# EAGLE design zero_board (EAGLE 6.6.0)
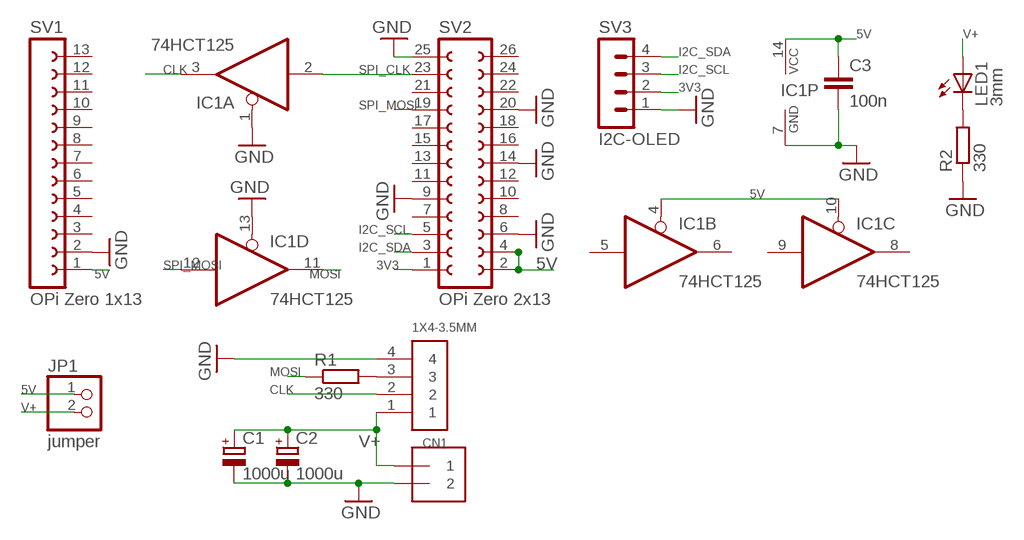
[diagram p0: schematic, sheet 1]

## Parts
C1  1000u  CPOL-EUE5-6  [E5-6]
C2  1000u  CPOL-EUE5-6  [E5-6]
C3  100n  C-EU050-024X044  [C050-024X044]
CN1  1X4-3.5MM  [1X04-3.5MM]
IC1  74HCT125  74HCT125N  [DIL14]
J1  1X2-3.5MM  [1X2-3.5MM]
JP1  jumper  PINHD-1X2  [1X02]
LED1  3mm  LED3MM  [LED3MM]
R1  330  R-EU_0204/7  [0204/7]
R2  330  R-EU_0204/7  [0204/7]
SV1  OPi Zero 1x13  FE13-1  [FE13]
SV2  OPi Zero 2x13  FE13-2  [FE13-2]
SV3  I2C-OLED  MA04-1  [MA04-1]

## Nets
3V3: SV2.1 SV3.2
5V: C3.1 IC1.4(B:OE) IC1.10(C:OE) IC1.14(P:VCC) JP1.1 SV1.1 SV2.2 SV2.4
CLK: CN1.2 IC1.3(A:O)
GND: C1.- C2.- C3.2 CN1.4 IC1.1(A:OE) IC1.7(P:GND) IC1.13(D:OE) J1.2 R2.1 SV1.2 SV2.6 SV2.9 SV2.14 SV2.20 SV2.25 SV3.1
I2C_SCL: SV2.5 SV3.3
I2C_SDA: SV2.3 SV3.4
MOSI: IC1.11(D:O) R1.1
N$1: LED1.K(C) R2.2
N$2: CN1.3 R1.2
SPI_CLK: IC1.2(A:I) SV2.23
SPI_MOSI: IC1.12(D:I) SV2.19
V+: C1.+ C2.+ CN1.1 J1.1 JP1.2 LED1.A
Unconnected: IC1.5(B:I) IC1.6(B:O) IC1.8(C:O) IC1.9(C:I) SV1.3 SV1.4 SV1.5 SV1.6 SV1.7 SV1.8 SV1.9 SV1.10 SV1.11 SV1.12 SV1.13 SV2.7 SV2.8 SV2.10 SV2.11 SV2.12 SV2.13 SV2.15 SV2.16 SV2.17 SV2.18 SV2.21 SV2.22 SV2.24 SV2.26

## Library data of the parts
C1 C2 = rcl:CPOL-EU: POLARIZED CAPACITOR, European symbol
C3 = rcl:C-EU: CAPACITOR, European symbol
CN1 = adafruit:1X4: 4-pin connector
IC1 = 74xx-eu:74*125: Quad bus BUFFER, 3-state
J1 = adafruit:1X2: 3.5mm Terminal block http://www.ladyada.net/library/pcb/eaglelibrary.html
JP1 = pinhead:PINHD-1X2: PIN HEADER
LED1 = led:LED: LED OSRAM: - CHIPLED LG R971, LG N971, LY N971, LG Q971, LY Q971, LO R971, LY R971 LH N974, LH R974 LS Q976, LO Q976, LY Q976 LO Q996 - Hyper CHIPLED LW Q18S LB Q993, LB Q99A, LB R99A - SideLED LS A670, LO A670, LY A670, LG A670, LP A670 LB A673, LV A673, LT A673, LW A673 LH A674 LY A675 LS A676, LA A676, LO A676, LY A676, LW A676 LS A679, LY A679, LG A679 - Hyper Micro SIDELED® LS Y876, LA Y876, LO Y876, LY Y876 LT Y87S - SmartLED LW L88C, LW L88S LB L89C, LB L89S, LG L890 LS L89K, LO L89K, LY L89K LS L896, LA L896, LO L896, LY L896 - TOPLED LS T670, LO T670, LY T670, LG T670, LP T670 LSG T670, LSP T670, LSY T670, LOP T670, LYG T670 LG T671, LOG T671, LSG T671 LB T673, LV T673, LT T673, LW T673 LH T674 LS T676, LA T676, LO T676, LY T676, LB T676, LH T676, LSB T676, LW T676 LB T67C, LV T67C, LT T67C, LS T67K, LO T67K, LY T67K, LW E67C LS E67B, LA E67B, LO E67B, LY E67B, LB E67C, LV E67C, LT E67C LW T67C LS T679, LY T679, LG T679 LS T770, LO T770, LY T770, LG T770, LP T770 LB T773, LV T773, LT T773, LW T773 LH T774 LS E675, LA E675, LY E675, LS T675 LS T776, LA T776, LO T776, LY T776, LB T776 LHGB T686 LT T68C, LB T68C - Hyper Mini TOPLED® LB M676 - Mini TOPLED Santana® LG M470 LS M47K, LO M47K, LY M47K Source: http://www.osram.convergy.de LUXEON: - LUMILED® LXK2-PW12-R00, LXK2-PW12-S00, LXK2-PW14-U00, LXK2-PW14-V00 LXK2-PM12-R00, LXK2-PM12-S00, LXK2-PM14-U00 LXK2-PE12-Q00, LXK2-PE12-R00, LXK2-PE12-S00, LXK2-PE14-T00, LXK2-PE14-U00 LXK2-PB12-K00, LXK2-PB12-L00, LXK2-PB12-M00, LXK2-PB14-N00, LXK2-PB14-P00, LXK2-PB14-Q00 LXK2-PR12-L00, LXK2-PR12-M00, LXK2-PR14-Q00, LXK2-PR14-R00 LXK2-PD12-Q00, LXK2-PD12-R00, LXK2-PD12-S00 LXK2-PH12-R00, LXK2-PH12-S00 LXK2-PL12-P00, LXK2-PL12-Q00, LXK2-PL12-R00 Source: www.luxeon.com KINGBRIGHT: KA-3528ASYC Source: www.kingbright.com
R1 R2 = rcl:R-EU_: RESISTOR, European symbol
SV1 = con-lsta:FE13-1: FEMALE HEADER; OC_FARNELL: unknown; OC_NEWARK: unknown
SV2 = con-lsta:FE13-2: FEMALE HEADER; OC_FARNELL: unknown; OC_NEWARK: unknown
SV3 = con-lstb:MA04-1: PIN HEADER; OC_FARNELL: unknown; OC_NEWARK: unknown

## Board
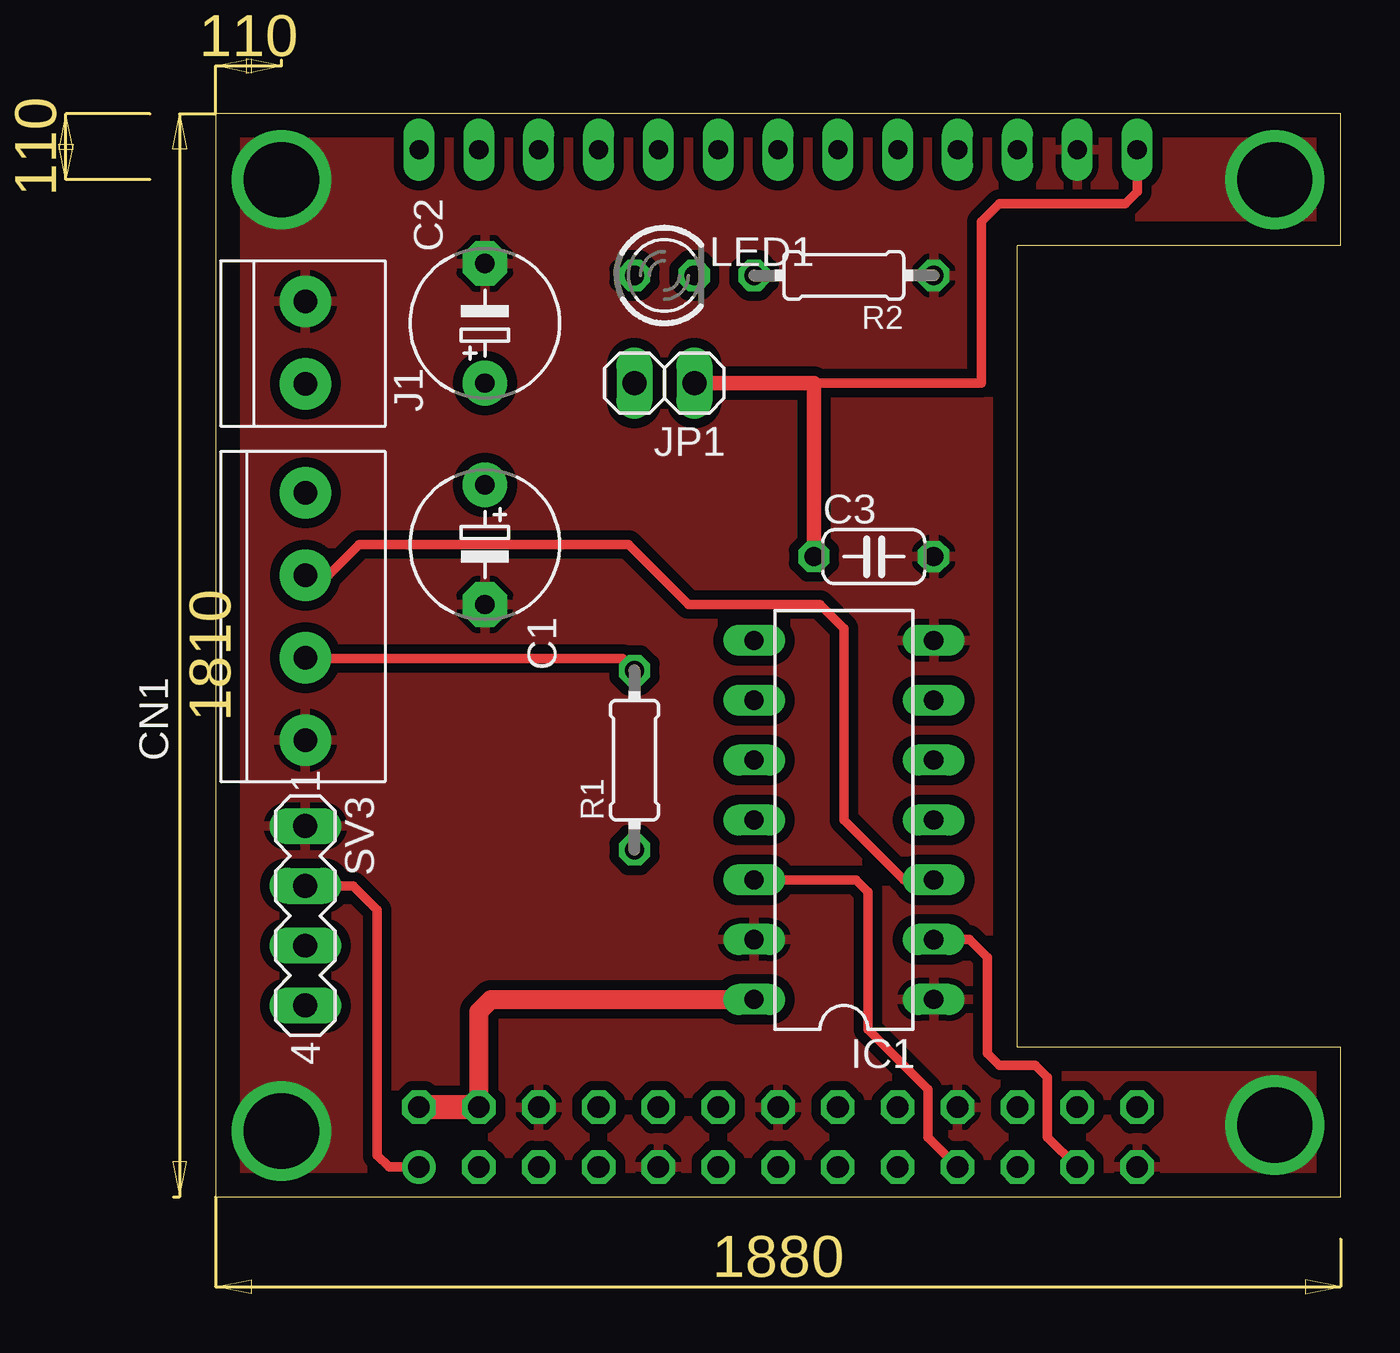
[diagram p1: board, top side]
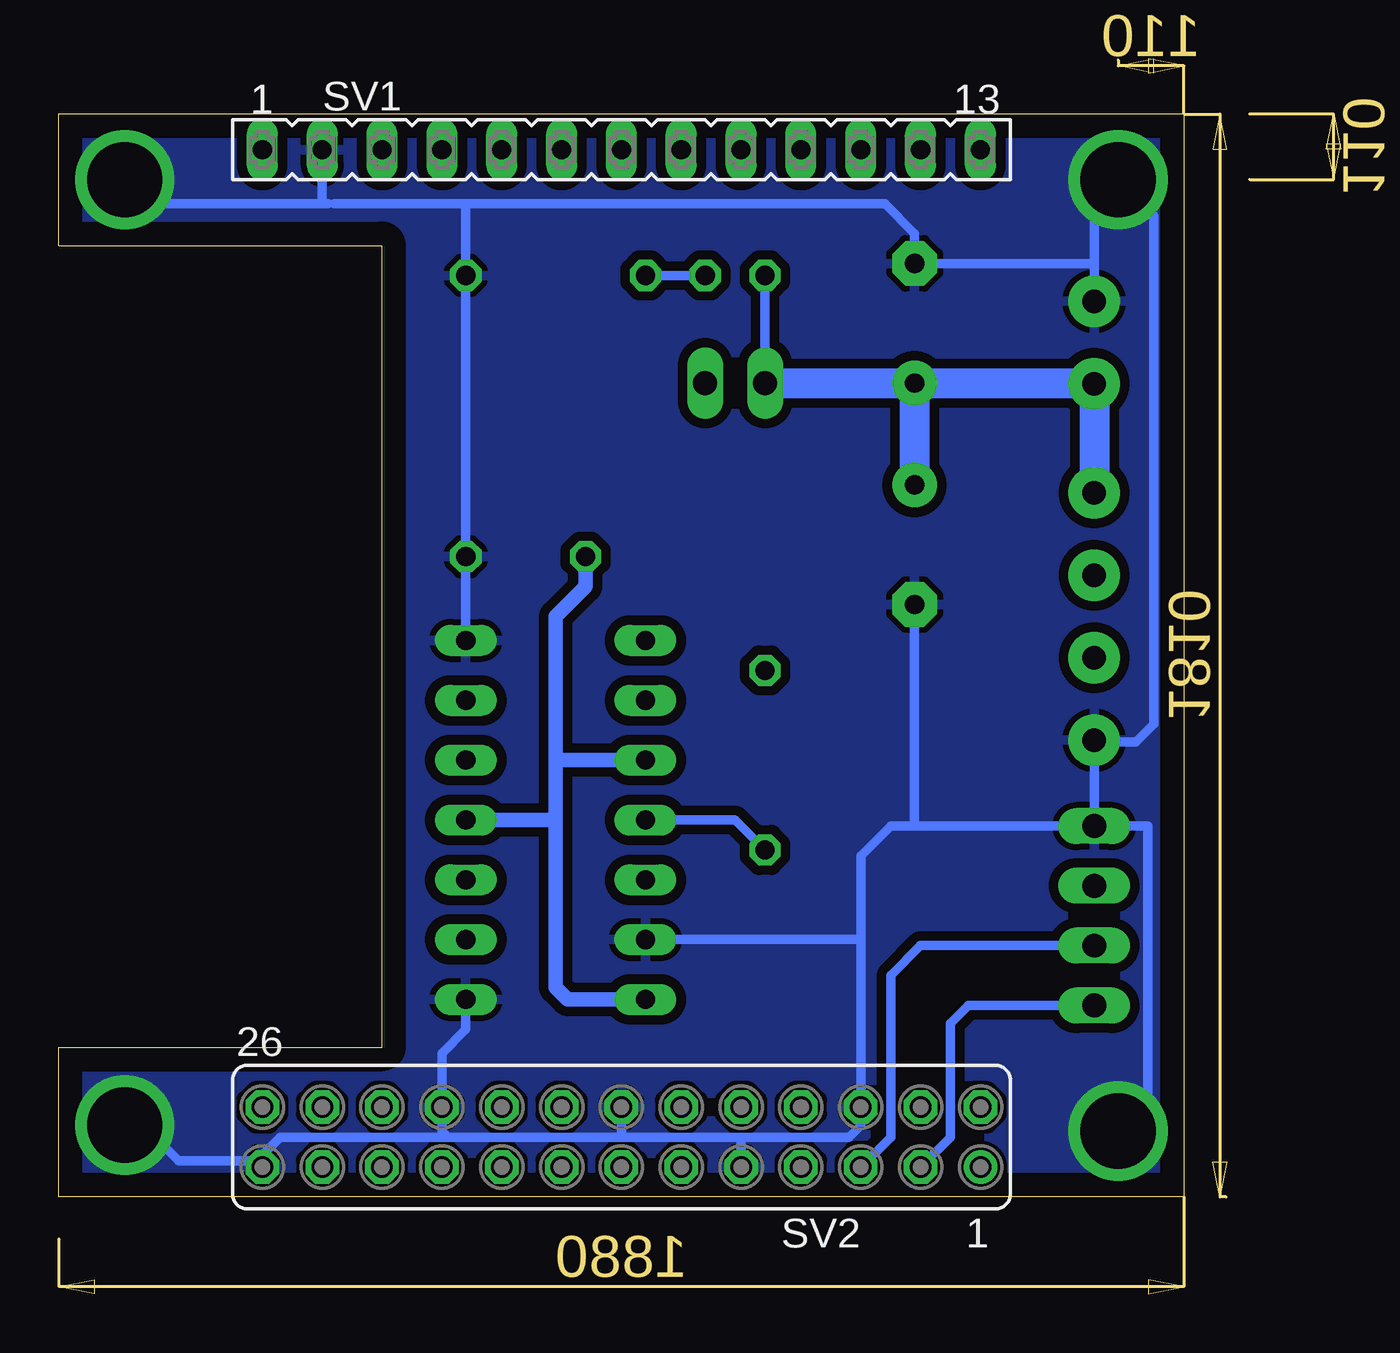
[diagram p2: board, bottom side, seen from below]

Size 47.75 x 45.97 mm. Coordinates in mm from the lower left corner, seen from the top.
Outline: 0,45.96 0,0 47.75,0 47.75,6.35 34.04,6.35 34.04,40.39 47.75,40.39 47.75,45.97 0,45.97
Copper layers (1*16): Top 0.035mm / dielectric 1.5mm / Bottom 0.035mm
Design rules "default": minimum track width 10mil, minimum drill 24mil, track to track 8mil, track to pad 8mil, pad to pad 8mil, via to via 8mil, smd to smd 8mil, copper to edge 40mil, drill to drill 8mil, minimum pad ring 10mil, minimum via ring 8mil, stop-mask expansion 4mil, vias tented up to drill 0mil, thermal gap 10mil

### Footprints (pad centres in the part's own frame; a part is rotated, then mirrored left to right if it is on the bottom)
E5-6 = drill 0.813 pad 1.905: + -2.54,0 | drill 0.813 pad 1.905 octagon: - 2.54,0
C050-024X044 = drill 0.813 octagon: 1 -2.54,0; 2 2.54,0
1X04-3.5MM = drill 1 pad 2.184: 1 -5.25,0; 2 -1.75,0; 3 1.75,0; 4 5.25,0
DIL14 = drill 0.813 long: 1 -7.62,-3.81; 2 -5.08,-3.81; 3 -2.54,-3.81; 4 0,-3.81; 5 2.54,-3.81; 6 5.08,-3.81; 7 7.62,-3.81; 8 7.62,3.81; 9 5.08,3.81; 10 2.54,3.81; 11 0,3.81; 12 -2.54,3.81; 13 -5.08,3.81; 14 -7.62,3.81
1X2-3.5MM = drill 1 pad 2.184: 1 1.8,0; 2 -1.7,0
1X02 = drill 1.016 long: 1 -1.27,0; 2 1.27,0
LED3MM = drill 0.813 octagon: A -1.27,0; K 1.27,0
0204/7 = drill 0.813 octagon: 1 -3.81,0; 2 3.81,0
FE13 = drill 0.813 long: 1 -15.24,0; 2 -12.7,0; 3 -10.16,0; 4 -7.62,0; 5 -5.08,0; 6 -2.54,0; 7 0,0; 8 2.54,0; 9 5.08,0; 10 7.62,0; 11 10.16,0; 12 12.7,0; 13 15.24,0
FE13-2 = drill 0.914: 1 -15.24,1.27 | drill 0.914 octagon: 2 -15.24,-1.27; 3 -12.7,1.27; 4 -12.7,-1.27; 5 -10.16,1.27; 6 -10.16,-1.27; 7 -7.62,1.27; 8 -7.62,-1.27; 9 -5.08,1.27; 10 -5.08,-1.27; 11 -2.54,1.27; 12 -2.54,-1.27; 13 0,1.27; 14 0,-1.27; 15 2.54,1.27; 16 2.54,-1.27; 17 5.08,1.27; 18 5.08,-1.27; 19 7.62,1.27; 20 7.62,-1.27; 21 10.16,1.27; 22 10.16,-1.27; 23 12.7,1.27; 24 12.7,-1.27; 25 15.24,1.27; 26 15.24,-1.27
MA04-1 = drill 1.016 long: 1 -3.81,0; 2 -1.27,0; 3 1.27,0; 4 3.81,0

### Placement (x,y rotation side)
C1  11.43,27.69 270 top
C2  11.43,37.08 90 top
C3  27.94,27.18 0 top
CN1  3.81,24.64 270 top
IC1  26.67,16 90 top
J1  3.81,36.32 270 top
JP1  19.05,34.54 180 top
LED1  19.05,39.12 0 top
R1  17.78,18.54 90 top
R2  26.67,39.12 180 top
SV1  23.88,44.45 0 bottom
SV2  23.88,2.54 180 bottom
SV3  3.81,11.94 270 top

### Tracks (layer width: path | path; a pad name or v marks a point on that pad's centre or on a via)
3V3
  Top 0.406: SV2.1 7.37,1.27 6.86,1.78 6.86,12.19 5.84,13.21 SV3.2
5V
  Top 0.406: 25.4,34.54 32.51,34.54 32.51,41.4 33.27,42.16 38.61,42.16 39.12,42.67 SV1.1
  Top 0.61: JP1.1 25.4,34.54 C3.1
  Top 0.813: SV2.4 11.18,7.87 11.68,8.38 IC1.14
  Top 1.016: SV2.4 SV2.2
  Bottom 0.61: 26.67,18.54 IC1.10 | IC1.14 26.16,8.38 26.67,8.89 26.67,16 | IC1.4 26.67,16 | 26.67,18.54 26.67,16 | C3.1 25.4,25.91 26.67,24.64 26.67,18.54
CLK
  Top 0.406: IC1.3 29.21,13.46 26.67,16 26.67,24.13 25.65,25.15 20.07,25.15 17.53,27.69 6.1,27.69 4.83,26.42 3.84,26.42 CN1.2
GND  (via drill 3.2)
  Bottom 0.406: v44.96,3.05 44.2,3.05 42.67,1.52 39.37,1.52 SV2.25 39.12,1.78 38.35,2.54 31.24,2.54 | J1.2 3.81,39.62 | 3.81,39.62 3.81,42.16 v2.79,43.18 1.27,41.66 1.27,20.07 2.03,19.3 3.81,19.3 | v44.96,43.18 44.2,43.18 43.18,42.16 36.58,42.16 | 36.58,42.16 36.32,42.16 | 3.81,39.62 C2.- 11.43,40.89 12.7,42.16 30.48,42.16 | 30.48,42.16 36.07,42.16 | SV1.2 36.58,42.16 | 31.24,2.54 31.5,2.79 SV2.20 31.5,6.1 30.48,7.11 IC1.1 | 24.13,3.81 SV2.14 23.88,2.54 | 31.24,2.54 23.88,2.54 | 23.88,2.54 18.8,2.54 | 18.8,2.54 14.22,2.54 13.72,3.05 SV2.6 13.72,10.92 | SV2.9 18.8,2.54 | SV3.1 1.52,15.75 1.52,4.06 v2.79,2.79 | 13.72,10.92 13.72,14.48 12.45,15.75 11.43,15.75 | CN1.4 3.81,19.3 | C1.- 11.43,15.75 | 11.43,15.75 SV3.1 | SV3.1 3.81,19.3 | IC1.7 C3.2 R2.1 30.48,42.16 | IC1.13 13.72,10.92
  pour Bottom (isolate 0.406): 47.75,0 -0.25,0 0,45.97 47.75,45.97 47.75,40.64 34.04,40.64 34.04,6.35 47.75,6.35
  pour Top (isolate 0.406): 47.75,0 47.75,6.35 34.04,6.35 34.04,40.39 47.75,40.39 47.75,45.97 0,45.97 0,0
I2C_SCL
  Bottom 0.406: SV2.5 12.45,2.54 12.45,9.4 11.18,10.67 SV3.3
I2C_SDA
  Bottom 0.406: SV2.3 9.91,2.54 9.91,7.37 9.14,8.13 SV3.4
MOSI
  Bottom 0.406: IC1.11 19.05,16 R1.1
N$1
  Bottom 0.406: LED1.K R2.2
N$2
  Top 0.406: R1.2 17.27,22.86 3.84,22.86 CN1.3
SPI_CLK
  Top 0.406: SV2.23 35.31,2.54 35.31,5.08 34.8,5.59 33.27,5.59 32.77,6.1 32.77,10.16 32,10.92 IC1.2
SPI_MOSI
  Top 0.406: SV2.19 30.23,2.54 30.23,4.57 27.69,7.11 27.69,12.95 27.18,13.46 IC1.12
V+
  Bottom 0.406: 3.83,34.54 J1.1 | JP1.2 LED1.A
  Bottom 1.27: J1.1 CN1.1 | C2.+ C1.+ | C2.+ 3.83,34.54 | JP1.2 C2.+